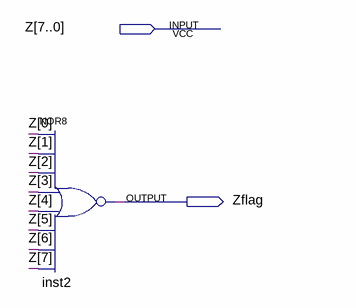
[diagram p0: schematic sheet]
// Quartus schematic ZF.bdf as structural Verilog: 1 symbols, 2 pins
module ZF (
  input  [7:0] Z,
  output Zflag
);

  nor inst2 (Zflag, Z[0], Z[1], Z[2], Z[3], Z[4], Z[5], Z[6], Z[7]);
endmodule
